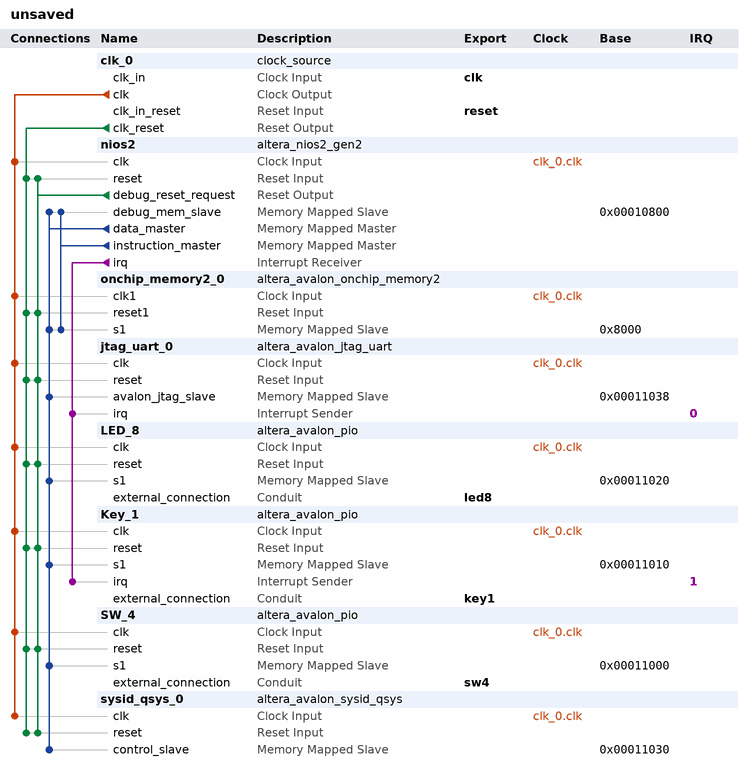
[diagram p0: system contents]
# Platform Designer (Qsys) system unsaved, MAX 10 10M50DAF484C7G
# Parameters at their usual value, and those the tool derives, are not listed.
package require -exact qsys 18.1
create_system unsaved
set_project_property DEVICE_FAMILY {MAX 10}
set_project_property DEVICE 10M50DAF484C7G

add_instance clk_0 clock_source 18.1
set_instance_parameter_value clk_0 clockFrequency 50000000

add_instance nios2 altera_nios2_gen2 18.1
set_instance_parameter_value nios2 dcache_size 2048
set_instance_parameter_value nios2 exceptionSlave onchip_memory2_0.s1
set_instance_parameter_value nios2 icache_size 4096
set_instance_parameter_value nios2 impl Fast
set_instance_parameter_value nios2 resetSlave onchip_memory2_0.s1

add_instance onchip_memory2_0 altera_avalon_onchip_memory2 18.1
set_instance_parameter_value onchip_memory2_0 dataWidth 32
set_instance_parameter_value onchip_memory2_0 dualPort false
set_instance_parameter_value onchip_memory2_0 initMemContent false
set_instance_parameter_value onchip_memory2_0 initializationFileName onchip_mem.hex
set_instance_parameter_value onchip_memory2_0 memorySize 32768

add_instance jtag_uart_0 altera_avalon_jtag_uart 18.1
set_instance_parameter_value jtag_uart_0 simInteractiveOptions NO_INTERACTIVE_WINDOWS

add_instance LED_8 altera_avalon_pio 18.1
set_instance_parameter_value LED_8 direction Output
set_instance_parameter_value LED_8 width 8

add_instance Key_1 altera_avalon_pio 18.1
set_instance_parameter_value Key_1 direction Input
set_instance_parameter_value Key_1 generateIRQ true
set_instance_parameter_value Key_1 width 1

add_instance SW_4 altera_avalon_pio 18.1
set_instance_parameter_value SW_4 direction Input
set_instance_parameter_value SW_4 width 4

add_instance sysid_qsys_0 altera_avalon_sysid_qsys 18.1
set_instance_parameter_value sysid_qsys_0 id 0

# connections
add_connection clk_0.clk jtag_uart_0.clk clock
add_connection clk_0.clk Key_1.clk clock
add_connection clk_0.clk LED_8.clk clock
add_connection clk_0.clk nios2.clk clock
add_connection clk_0.clk onchip_memory2_0.clk1 clock
add_connection clk_0.clk SW_4.clk clock
add_connection clk_0.clk sysid_qsys_0.clk clock
add_connection clk_0.clk_reset jtag_uart_0.reset reset
add_connection clk_0.clk_reset Key_1.reset reset
add_connection clk_0.clk_reset LED_8.reset reset
add_connection clk_0.clk_reset nios2.reset reset
add_connection clk_0.clk_reset onchip_memory2_0.reset1 reset
add_connection clk_0.clk_reset SW_4.reset reset
add_connection clk_0.clk_reset sysid_qsys_0.reset reset
add_connection nios2.debug_reset_request jtag_uart_0.reset reset
add_connection nios2.debug_reset_request Key_1.reset reset
add_connection nios2.debug_reset_request LED_8.reset reset
add_connection nios2.debug_reset_request nios2.reset reset
add_connection nios2.debug_reset_request onchip_memory2_0.reset1 reset
add_connection nios2.debug_reset_request SW_4.reset reset
add_connection nios2.debug_reset_request sysid_qsys_0.reset reset
add_connection nios2.data_master jtag_uart_0.avalon_jtag_slave avalon
set_connection_parameter_value nios2.data_master/jtag_uart_0.avalon_jtag_slave baseAddress 0x00011038
add_connection nios2.data_master Key_1.s1 avalon
set_connection_parameter_value nios2.data_master/Key_1.s1 baseAddress 0x00011010
add_connection nios2.data_master LED_8.s1 avalon
set_connection_parameter_value nios2.data_master/LED_8.s1 baseAddress 0x00011020
add_connection nios2.data_master nios2.debug_mem_slave avalon
set_connection_parameter_value nios2.data_master/nios2.debug_mem_slave baseAddress 0x00010800
add_connection nios2.data_master onchip_memory2_0.s1 avalon
set_connection_parameter_value nios2.data_master/onchip_memory2_0.s1 baseAddress 0x8000
add_connection nios2.data_master SW_4.s1 avalon
set_connection_parameter_value nios2.data_master/SW_4.s1 baseAddress 0x00011000
add_connection nios2.data_master sysid_qsys_0.control_slave avalon
set_connection_parameter_value nios2.data_master/sysid_qsys_0.control_slave baseAddress 0x00011030
add_connection nios2.instruction_master nios2.debug_mem_slave avalon
set_connection_parameter_value nios2.instruction_master/nios2.debug_mem_slave baseAddress 0x00010800
add_connection nios2.instruction_master onchip_memory2_0.s1 avalon
set_connection_parameter_value nios2.instruction_master/onchip_memory2_0.s1 baseAddress 0x8000
add_connection nios2.irq jtag_uart_0.irq interrupt
set_connection_parameter_value nios2.irq/jtag_uart_0.irq irqNumber 0
add_connection nios2.irq Key_1.irq interrupt
set_connection_parameter_value nios2.irq/Key_1.irq irqNumber 1

# exported interfaces
add_interface clk clock sink
set_interface_property clk EXPORT_OF clk_0.clk_in
add_interface key1 conduit end
set_interface_property key1 EXPORT_OF Key_1.external_connection
add_interface led8 conduit end
set_interface_property led8 EXPORT_OF LED_8.external_connection
add_interface reset reset sink
set_interface_property reset EXPORT_OF clk_0.clk_in_reset
add_interface sw4 conduit end
set_interface_property sw4 EXPORT_OF SW_4.external_connection

set_interconnect_requirement {$system} qsys_mm.clockCrossingAdapter HANDSHAKE
set_interconnect_requirement {$system} qsys_mm.enableEccProtection FALSE
set_interconnect_requirement {$system} qsys_mm.insertDefaultSlave FALSE
set_interconnect_requirement {$system} qsys_mm.maxAdditionalLatency 1

save_system unsaved.qsys
